# Altium schematic sheet Sheet1.SchDoc
size 420 x 297 mm; Address1: Address1; Address2: Address2; Address3: Address3; Address4: Address4; DocumentNumber: АБВГ.123456.001 Э3; SheetNumber: 1; Scale: 1:1; DocumentType: Схема электрическая принципиальная; FirstReferrence: АБВГ.123456.001
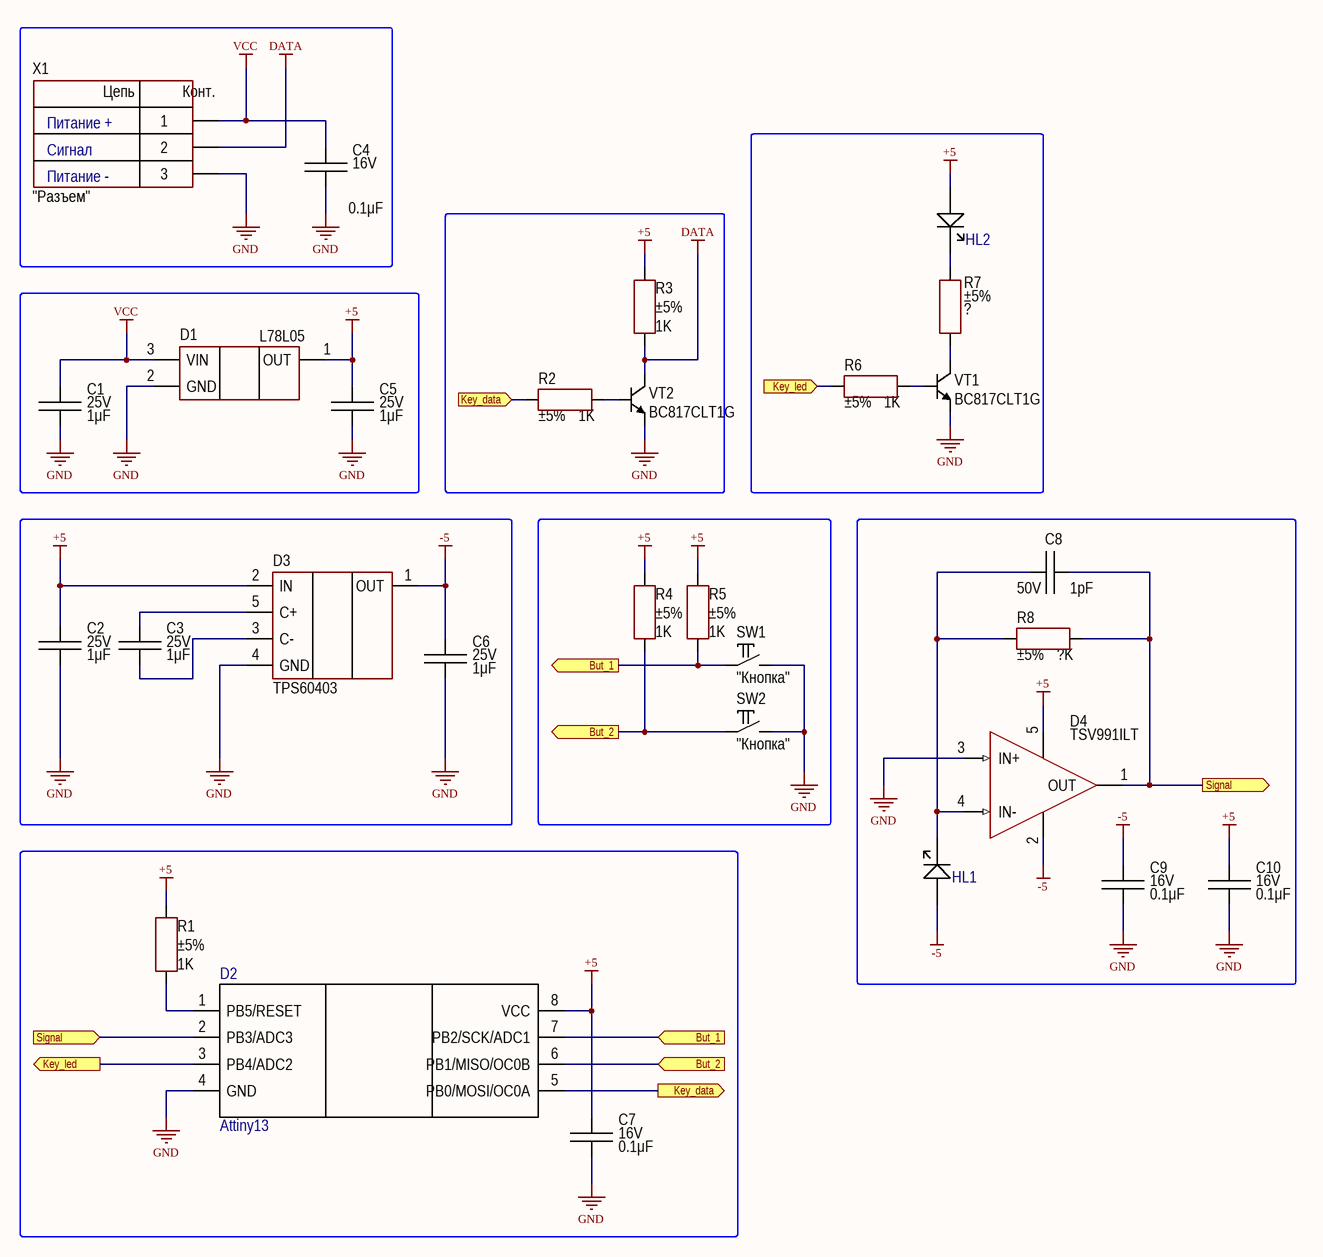
[diagram p0: Sheet1.SchDoc]

## Parts
C1  value 1μF  Voltage: 25V  [CAP: 0603]
C2  value 1μF  Voltage: 25V  [CAP: 0603]
C3  value 1μF  Voltage: 25V  [CAP: 0603]
C4  value 0.1μF  Voltage: 16V  [CAP: 0603]
C5  value 1μF  Voltage: 25V  [CAP: 0603]
C6  value 1μF  Voltage: 25V  [CAP: 0603]
C7  value 0.1μF  Voltage: 16V  [CAP: 0603]
C8  value 1pF  Voltage: 50V  [CAP: 1206]
C9  value 0.1μF  Voltage: 16V  [CAP: 0603]
C10  value 0.1μF  Voltage: 16V  [CAP: 0603]
D1  (no value)  [SOT89]
D2  Attiny13  [8-SOIC]
D3  (no value)  [SOT23-5]
D4  PartNumber: TSV991ILT  [SOT23-5]
HL1  *  [LED: 5mm (H:0mm)(blue)]  (value not drawn)
HL2  *  [LED: 5mm (H:0mm)(red)]  (value not drawn)
R1  value 1K  Tolerance: ±5%  [RES: 0603]
R2  value 1K  Tolerance: ±5%  [RES: 0603]
R3  value 1K  Tolerance: ±5%  [RES: 0603]
R4  value 1K  Tolerance: ±5%  [RES: 0603]
R5  value 1K  Tolerance: ±5%  [RES: 0603]
R6  value 1K  Tolerance: ±5%  [RES: 0603]
R7  Tolerance: ±5%  [RES: 0603]
R8  value ?K  Tolerance: ±5%  [RES: 1206]
SW1  CommentText: "Кнопка"  [BUT: 3x4x2 SMT]
SW2  CommentText: "Кнопка"  [BUT: 3x4x2 SMT]
VT1  PartNumber: BC817CLT1G  [SC-70]
VT2  PartNumber: BC817CLT1G  [SC-70]
X1  CommentText: "Разъем"  [CON: PLS-3]

## Ports
But_1 (in), But_1 (out), But_2 (in), But_2 (out), Key_data (in), Key_data (out), Key_led (in), Key_led (out), Signal (in), Signal (out)

## Nets
+5: C2.2 C5.2 C7.2 C10.2 D1.1(OUT) D2.8(VCC) D3.2(IN) D4.5(V+) HL2.2 R1.1 R3.1 R4.1 R5.1
-5: C6.2 C9.2 D3.1(OUT) D4.2(V-) HL1.2
DATA: R3.2 VT2.3(C) X1.2
GND: C1.1 C2.1 C4.1 C5.1 C6.1 C7.1 C9.1 C10.1 D1.2(GND) D2.4(GND) D3.4(GND) D4.3(IN+) SW1.2 SW2.2 VT1.2(E) VT2.2(E) X1.3
VCC: C1.2 C4.2 D1.3(VIN) X1.1
But_1: D2.7(PB2/SCK/ADC1) R5.2 SW1.1 ; port But_1
But_2: D2.6(PB1/MISO/OC0B) R4.2 SW2.1 ; port But_2
Key_data: D2.5(PB0/MOSI/OC0A) R2.2 ; port Key_data
Key_led: D2.3(PB4/ADC2) R6.2 ; port Key_led
Signal: C8.1 D2.2(PB3/ADC3) D4.1(OUT) R8.2 ; port Signal
NetC3_1: C3.1 D3.3(C-)
NetC3_2: C3.2 D3.5(C+)
NetC8_2: C8.2 D4.4(IN-) HL1.1 R8.1
NetD2_1: D2.1(PB5/RESET) R1.2
NetHL2_1: HL2.1 R7.2
NetR2_1: R2.1 VT2.1(B)
NetR6_1: R6.1 VT1.1(B)
NetR7_1: R7.1 VT1.3(C)

## Notes on the sheet
- Питание +
- Сигнал
- Питание -
- Перв. примен.
- Справ. №
- Подп. и дата
- Инв. № дубл.
- Взам. инв. №
- Разраб.
- Изм.
- Лист
- № докум.
- Подп.
- Дата
- Лит.
- Масса
- Масштаб
- Пров.
- Т.контр.
- Листов
- Инв. № подл.
- Утв.
- Н.контр.
- 2.106-A3
- Копировал
- Формат А3
- (in symbol PLS-3) Цепь; Конт.

## Library data of the parts
C1-C3 C5 C6 = Ceramic_0603: Manufacturer: Yageo; PartNumber: CC0603KRX7R7BB104; ValueManufacturerPartNumber: Ceramic capacitor, 1μF, X7R, ±10%, 25V, 0603, -55...+125°C; TypeCapacitor: Ceramic capacitor; Tolerance: ±10%; TypeDielectric: X7R; Package: 0603; HelpURL: https://www.digikey.com/product-detail/en/yageo/CC0603KRX7R7BB104/311-1088-1-ND/302998; Temperature: -55...+125°C
C4 C7 C9 C10 = Ceramic_0603: Manufacturer: Yageo; PartNumber: CC0603KRX7R7BB104; ValueManufacturerPartNumber: Ceramic capacitor, 0.1μF, X7R, ±10%, 16V, 0603, -55...+125°C; TypeCapacitor: Ceramic capacitor; Tolerance: ±10%; TypeDielectric: X7R; Package: 0603; HelpURL: https://www.digikey.com/product-detail/en/yageo/CC0603KRX7R7BB104/311-1088-1-ND/302998; Temperature: -55...+125°C
C8 = Ceramic_1206: Manufacturer: Yageo; PartNumber: CC1206KRX7R9BB104; ValueManufacturerPartNumber: Ceramic capacitor, 1pF, X7R, ±10%, 50V, 1206, -55...+125°C; TypeCapacitor: Ceramic capacitor; Tolerance: ±10%; TypeDielectric: X7R; Package: 1206; HelpURL: https://www.digikey.com/product-detail/en/yageo/CC1206KRX7R9BB104/311-1179-1-ND/303089; Temperature: -55...+125°C
D1 = L78L05: Positive voltage regulators; ValueManufacturerPartNumber: Linear voltage regulator, input 3.9...18V, 0.6V, output 5V, 0.1A, -40...+85°C, SOT-89; VoltageInput: input 3.9...18V; MaxDropout: 0.6V; CurrentOutput: 0.1A; VoltageOutput: output 5V; HelpURL: https://belchip.by/sitedocs/00000471.pdf; Package: SOT-89; ComponentType: Linear voltage regulator; Temperature: -40...+85°C; PartNumber: L78L05
D2 = ATtiny13 SO-8: Value: Attiny13
D3 = TPS60403: Voltage Inverter; HelpURL: https://www.ti.com/lit/ds/symlink/tps60400-q1.pdf?ts=1617708425560&ref_url=https%253A%252F%252Fwww.google.com%252F; Package: SOT23-5; ValueManufacturerPartNumber: =ComponentType+', '+VoltageInput+', '+Frequency+', '+OutputType+', '+TypeConverter+', '+Temperature+', '+Package; Temperature: -40...+150°C; PartNumber: TPS60403
D4 = AD8541ARZ: OP amplifier; Manufacturer: STMicroelectronics; ValueManufacturerPartNumber: IC op amplifier, Rail-to-Rail, 20 MHz, 2.7...5.5V, -40...+125°C, SOT23-5; Supply: 2.7...5.5V; OutputType: Rail-to-Rail; GainBandwidth: 20 MHz; HelpURL: https://www.chipdip.by/product/ad8541ar; Package: SOT23-5; ComponentType: IC op amplifier; Temperature: -40...+125°C
HL1 HL2 = Led: HelpURL: https://www.vishay.com/docs/82437/vlmo1300.pdf; Calor: *; Value: *
R1-R6 = Resistor_0603: Manufacturer: Yageo; PartNumber: RC0603JR-07100RL; ValueManufacturerPartNumber: Resistor film, 1K, ±5%, 0603, 0.1W, -55...+125°C; TypeResistor: Resistor film; Power: 0.1W; Package: 0603; HelpURL: https://www.digikey.com/product-detail/en/yageo/RC0603JR-07100RL/311-100GRCT-ND/729644; Temperature: -55...+125°C
R7 = Resistor_0603: Manufacturer: Yageo; PartNumber: RC0603JR-07100RL; ValueManufacturerPartNumber: Resistor film, ?, ±5%, 0603, 0.1W, -55...+125°C; TypeResistor: Resistor film; Power: 0.1W; Package: 0603; HelpURL: https://www.digikey.com/product-detail/en/yageo/RC0603JR-07100RL/311-100GRCT-ND/729644; Temperature: -55...+125°C; Value: ?
R8 = Resistor_1206: Manufacturer: Yageo; PartNumber: RC1206JR-07100RL; ValueManufacturerPartNumber: Resistor film, ?K, ±5%, 1206, 0.25W, -55...+125°C; TypeResistor: Resistor film; Power: 0.25W; Package: 1206; HelpURL: https://www.digikey.com/product-detail/en/yageo/RC1206JR-07100RL/311-100ERCT-ND/732153; Temperature: -55...+125°C
SW1 SW2 = Button_3x4x2_SMT: SMT 3*4*2 2PIN; Manufacturer: xin cheng electronic; HelpURL: https://aliexpress.ru/item/32309509976.html?spm=a2g0v.12010612.8148356.51.441f61b1yUlL0Q; ValueManufacturerPartNumber: =TypeButton+', '+Package; PartNumber: 3*4*2 2PIN; Package: 3*4*2mm
VT1 VT2 = Bipolar_NPN: Manufacturer: ON Semiconductor; ValueManufacturerPartNumber: NPN transistor, 45V, 100mA, 100MHz, 300mW, 0.6V, 420, SOT-23, -55...+125°C; TypeTransistor: NPN transistor; VoltageCE: 45V; CurrentCE: 100mA; VoltageSaturation: 0.6V; Frequency: 100MHz; CurrentGain: 420; MaxPower: 300mW; Package: SOT-23; HelpURL: https://www.digikey.com/product-detail/en/on-semiconductor/BC847CLT1G/BC847CLT1GOSCT-ND/917836; Temperature: -55...+125°C
X1 = PLS-3: Manufacturer: Connfly; ValueManufacturerPartNumber: Connector, 3pin, 2.54mm, 500VAC, 3A; TypeConnector: Connector; VoltageMax: 500VAC; Pitch: 2.54mm; CurrentMax: 3A; Multichannel: 3pin; HelpURL: https://www.chipdip.ru/product/pls-3; PartNumber: PLS-3